# EAGLE schematic v1 (EAGLE 7.6.0)
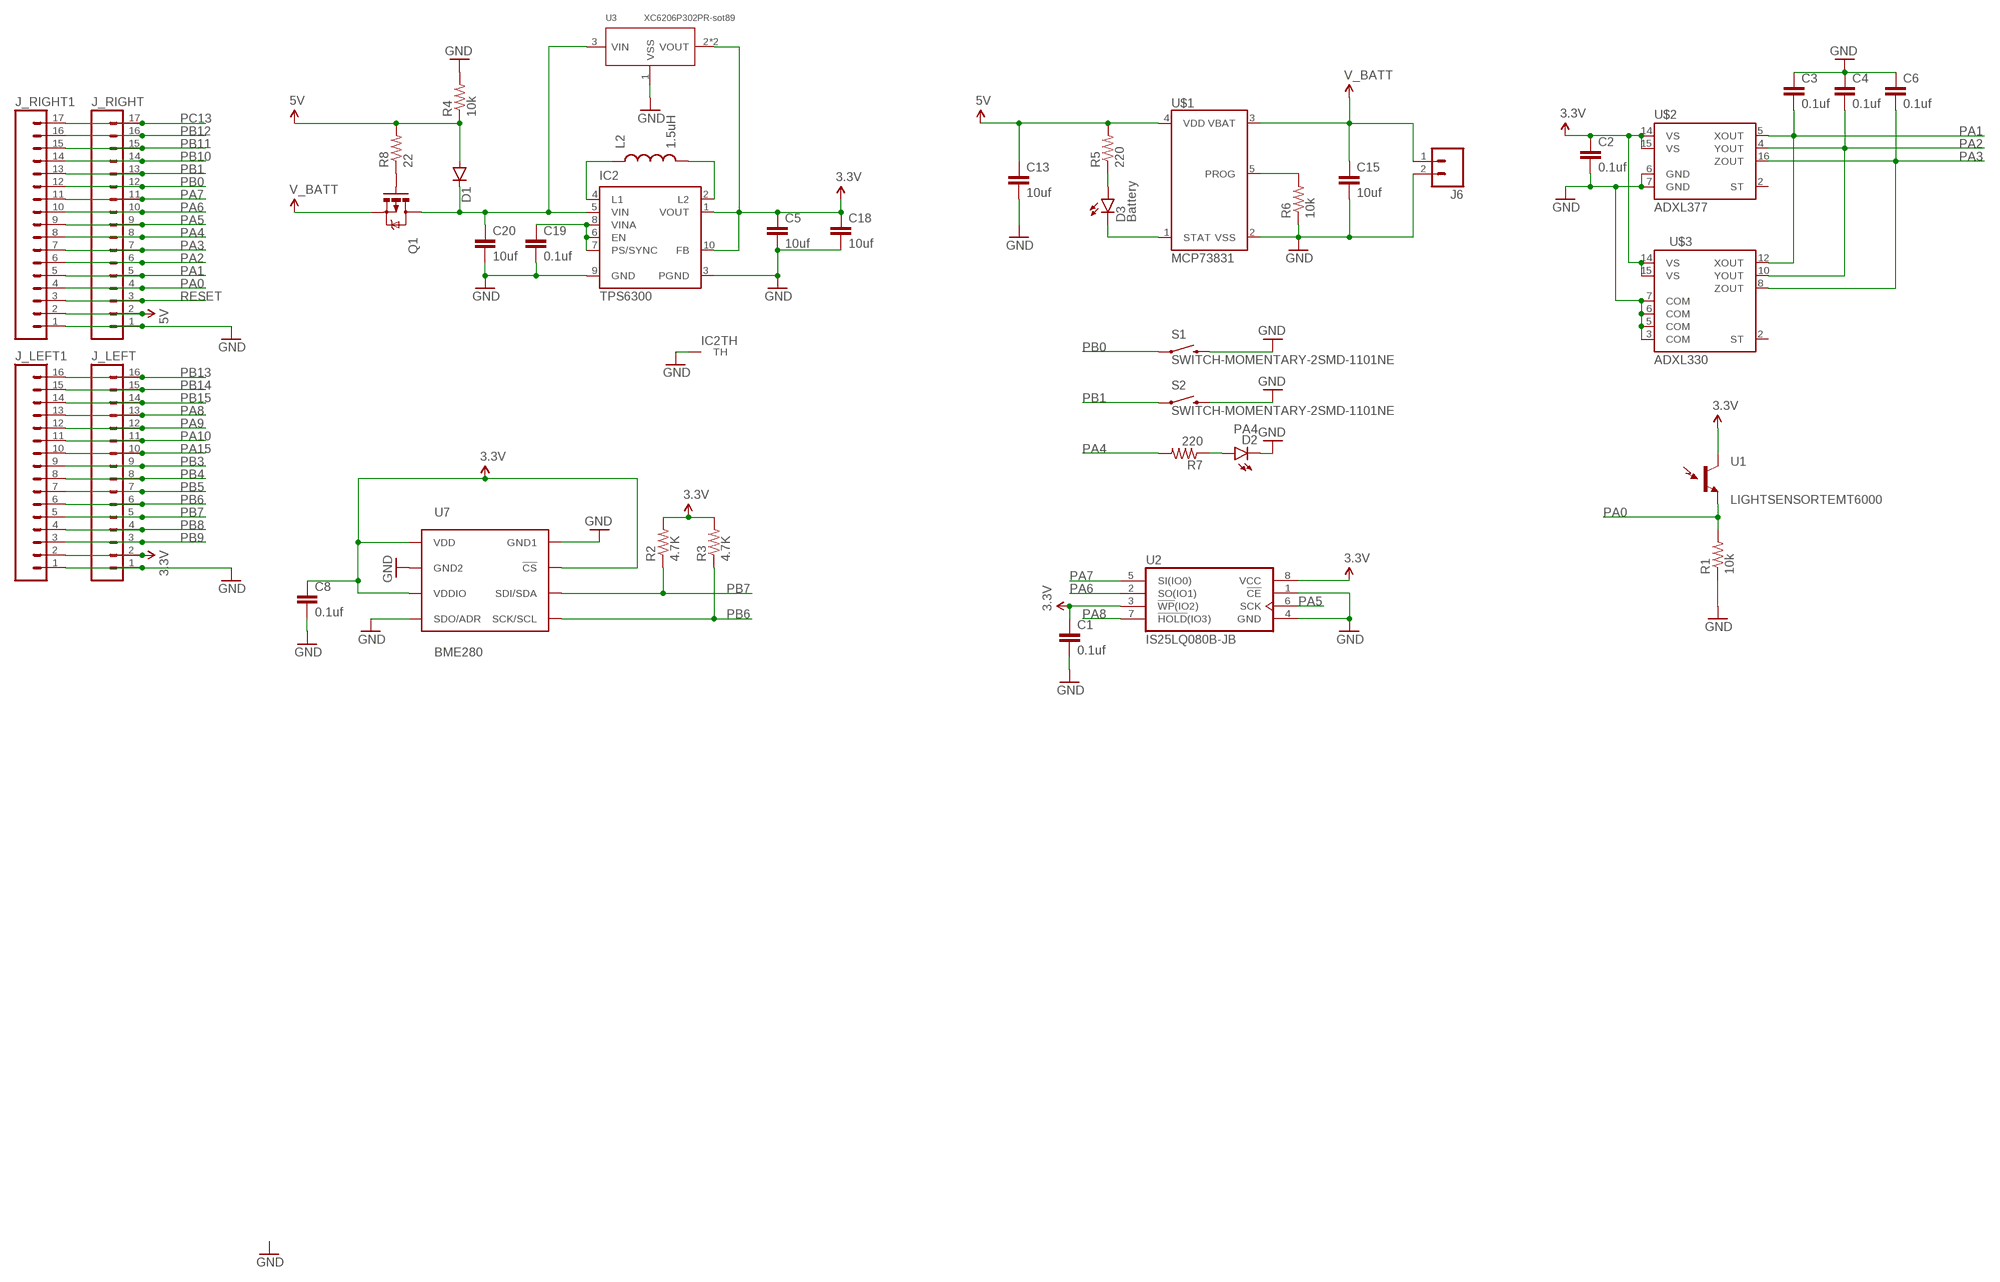
[diagram p0: schematic, sheet 1]

## Parts
C1  0.1uf  CAP0805  [0805]
C2  0.1uf  CAP0805  [0805]
C3  0.1uf  CAP0805  [0805]
C4  0.1uf  CAP0805  [0805]
C5  10uf  CAP0805  [0805]
C6  0.1uf  CAP0805  [0805]
C8  0.1uf  CAP0805  [0805]
C13  10uf  CAP0805  [0805]
C15  10uf  CAP0805  [0805]
C18  10uf  CAP0805  [0805]
C19  0.1uf  CAP0805  [0805]
C20  10uf  CAP0805  [0805]
D1  DIODESOD123  [SOD-123]
D2  PA4  LED1206  [LED-1206]
D3  Battery  LED1206  [LED-1206]
IC2  TPS6300  [DRC-S-PVSON-N10]
J6  M021X02_NO_SILK  [1X02_NO_SILK]
J_LEFT  M161X16_NO_SILK  [1X16_NO_SILK]
J_LEFT1  M161X16_NO_SILK  [1X16_NO_SILK]
J_RIGHT  M17NOSILK  [1X17_NO_SILK]
J_RIGHT1  M17NOSILK  [1X17_NO_SILK]
L2  1.5uH  INDUCTORBOURNS_SRN6045  [SRN6045]
Q1  MOSFET-PCHANNEL  [SOT23-3]
R1  10k  RESISTOR0805-RES  [0805]
R2  4.7K  RESISTOR0805-RES  [0805]
R3  4.7K  RESISTOR0805-RES  [0805]
R4  10k  RESISTOR0805-RES  [0805]
R5  220  RESISTOR0805-RES  [0805]
R6  10k  RESISTOR0805-RES  [0805]
R7  220  RESISTOR0805-RES  [0805]
R8  22  RESISTOR0805-RES  [0805]
S1  SWITCH-MOMENTARY-2SMD-1101NE  [TACTILE-SWITCH-1101NE]
S2  SWITCH-MOMENTARY-2SMD-1101NE  [TACTILE-SWITCH-1101NE]
U1  LIGHTSENSORTEMT6000  [TEMT6000-SEN]
U2  IS25LQ080B-JB  [SO08-JB]
U3  XC6206P302PR-sot89  PMIC-XC6206P302PR(SOT-89)  [SOT-89]
U7  BME280  [BME280_LGA]
U$1  MCP73831  [SOT23-5]
U$2  ADXL377  [LFCSP_LQ-16]
U$3  ADXL330  ADXL330SMD  [LFCSP-16]

## Nets
3.3V: C1.1 C2.1 C5.1 C8.1 C18.1 IC2.1(VOUT) IC2.10(FB) J_LEFT1.2 J_LEFT.2 R2.2 R3.2 U1.COLLECTOR(C1) U2.3(!WP!(IO2)) U2.8(VCC) U3.2(VOUT) U3.4(VOUT) U7.P$2(!CS) U7.P$6(VDDIO) U7.P$8(VDD) U$2.14(VS) U$2.15(VS) U$3.14(VS) U$3.15(VS)
5V: C13.1 D1.A J_RIGHT1.2 J_RIGHT.2 R4.1 R5.2 R8.2 U$1.4(VDD)
GND: C1.2 C2.2 C3.1 C4.1 C5.2 C6.1 C8.2 C13.2 C15.2 C18.2 C19.2 C20.2 D2.C IC2.3(PGND) IC2.9(GND) IC2.TH J6.2 J_LEFT1.1 J_LEFT.1 J_RIGHT1.1 J_RIGHT.1 R1.1 R4.2 R6.1 S1.2 S2.2 U2.1(!CE!) U2.4(GND) U3.1(VSS) U7.P$1(GND1) U7.P$5(SDO/ADR) U7.P$7(GND2) U$1.2(VSS) U$2.6(GND) U$2.7(GND) U$3.3(COM) U$3.5(COM) U$3.6(COM) U$3.7(COM)
N$1: IC2.4(L1) L2.1
N$3: IC2.2(L2) L2.2
N$4: C20.1 D1.C IC2.5(VIN) Q1.3(D) U3.3(VIN)
N$5: D2.A R7.1
N$6: Q1.1(G) R8.1
N$13: D3.A R5.1
N$14: C19.1 IC2.6(EN) IC2.7(PS/SYNC) IC2.8(VINA)
N$17: D3.C U$1.1(STAT)
N$18: R6.2 U$1.5(PROG)
PA0: J_RIGHT1.4 J_RIGHT.4 R1.2 U1.EMITTER(E1)
PA1: C3.2 J_RIGHT1.5 J_RIGHT.5 U$2.5(XOUT) U$3.12(XOUT)
PA2: C4.2 J_RIGHT1.6 J_RIGHT.6 U$2.4(YOUT) U$3.10(YOUT)
PA3: C6.2 J_RIGHT1.7 J_RIGHT.7 U$2.16(ZOUT) U$3.8(ZOUT)
PA4: J_RIGHT1.8 J_RIGHT.8 R7.2
PA5: J_RIGHT1.9 J_RIGHT.9 U2.6(SCK)
PA6: J_RIGHT1.10 J_RIGHT.10 U2.2(SO(IO1))
PA7: J_RIGHT1.11 J_RIGHT.11 U2.5(SI(IO0))
PA8: J_LEFT1.13 J_LEFT.13 U2.7(!HOLD!(IO3))
PA9: J_LEFT1.12 J_LEFT.12
PA10: J_LEFT1.11 J_LEFT.11
PA15: J_LEFT1.10 J_LEFT.10
PB0: J_RIGHT1.12 J_RIGHT.12 S1.1
PB1: J_RIGHT1.13 J_RIGHT.13 S2.1
PB3: J_LEFT1.9 J_LEFT.9
PB4: J_LEFT1.8 J_LEFT.8
PB5: J_LEFT1.7 J_LEFT.7
PB6: J_LEFT1.6 J_LEFT.6 R3.1 U7.P$4(SCK/SCL)
PB7: J_LEFT1.5 J_LEFT.5 R2.1 U7.P$3(SDI/SDA)
PB8: J_LEFT1.4 J_LEFT.4
PB9: J_LEFT1.3 J_LEFT.3
PB10: J_RIGHT1.14 J_RIGHT.14
PB11: J_RIGHT1.15 J_RIGHT.15
PB12: J_RIGHT1.16 J_RIGHT.16
PB13: J_LEFT1.16 J_LEFT.16
PB14: J_LEFT1.15 J_LEFT.15
PB15: J_LEFT1.14 J_LEFT.14
PC13: J_RIGHT1.17 J_RIGHT.17
RESET: J_RIGHT1.3 J_RIGHT.3
V_BATT: C15.1 J6.1 Q1.2(S) U$1.3(VBAT)
Unconnected: U$2.2(ST) U$3.2(ST)

## Library data of the parts
C1-C6 C8 C13 C15 C18-C20 = SparkFun-Capacitors:CAP: Capacitor Standard 0603 ceramic capacitor, and 0.1" leaded capacitor.
D1 = SparkFun-DiscreteSemi:DIODE: Diode These are standard reverse protection diodes and small signal diodes. SMA package can handle up to about 1A. SOD-323 can handle about 200mA. What the SOD-323 package when ordering, there are some mfgs out there that are 5-pin packages.
D2 D3 = SparkFun-LED:LED: LEDs Standard schematic elements and footprints for 5mm, 3mm, 1206, and 0603 sized LEDs. 5mm - Spark Fun Electronics SKU : COM-00529 (and others)
IC2 = texas:TPS6300*: HIGH EFFICIENT SINGLE INDUCTOR BUCK-BOOST CONVERTER WITH 1.8-A SWITCHES Source: http://focus.ti.com/lit/ds/symlink/tps63001.pdf; MPN: TPS63000DRCTG4; OC_FARNELL: 1511852; OC_NEWARK: 59M7217
J6 = SparkFun-Connectors:M02: Standard 2-pin 0.1" header. Use with - straight break away headers ( PRT-00116) - right angle break away headers (PRT-00553) - swiss pins (PRT-00743) - machine pins (PRT-00117) - female headers (PRT-00115) Molex polarized connector foot print use with: PRT-08233 with associated crimp pins and housings. 2.54_SCREWTERM for use with PRT-10571. 3.5mm Screw Terminal footprints for PRT-08084 5mm Screw Terminal footprints for use with PRT-08432
J_LEFT J_LEFT1 = SparkFun-Connectors:M16: 1x16 .1" header
J_RIGHT J_RIGHT1 = SparkFun-Connectors:M17: 1x17 .1" header
L2 = SparkFun-Passives:INDUCTOR: Inductors Basic Inductor/Choke - 0603 and 1206. Footprints are not proven and vary greatly between part numbers. INDUCTOR POWER 3.3UH 4.0A SMD 0.197" L x 0.197" W x 0.177" H (5.00mm x 5.00mm x 4.50mm); PROD_ID: NDUC-11627; VALUE: 33uH
Q1 = SparkFun-DiscreteSemi:MOSFET-PCHANNEL: Generic PMOSFET IRLML2244 - TRANS-11153 (SOT-23 -20V -4.3A) (1.Gate 2.Source 3.Drain) FQP27P06 - COM-10349 <http://www.sparkfun.com/products/10349> (TO-220 -60V -27A) (1.Gate 2.Source 3.Drain); PROD_ID: TRANS-08285
R1-R8 = SparkFun-Resistors:RESISTOR: Resistor Basic schematic elements and footprints for 0603, 1206, and PTH resistors.
S1 S2 = SparkFun-Electromechanical:SWITCH-MOMENTARY-2: Various NO switches- pushbuttons, reed, etc; PROD_ID: SWCH-00815
U1 = SparkFun-Sensors:LIGHTSENSOR: Ambient Light Sensor Simple light detection sensor. Output varies with light intensity input. Spark Fun Electronics SKU : COM-08348
U2 = memory-issi:IS25LQ080B-: EEPROM - 8 Mbit Serial Flash 3V QUAD SERIAL FLASH MEMORY WITH MULTI-I/O SPI
U3 = Seeed-OPL-ic:PMIC-XC6206P302PR(SOT-89): 310030070; MPN: XC6206P302PR
U7 = BME280ComponentLibrary:BME280; PROD_ID: IC-13090
U$1 = GeekAmmo:MCP73831: MCP73831 Miniature Single-Cell, Fully Integrated Li-Ion, Li-Polymer Charge Management Controllers The MCP73831/2 devices are highly advanced linear charge management controllers for use in spacelimited, cost-sensitive applications. http://ww1.microchip.com/downloads/en/DeviceDoc/20001984F.pdf
U$2 = SparkFun-Sensors:ADXL377: ADXL377 Low Power 3-Axis ±200 g Accelerometer with Analog Output.
U$3 = SparkFun-Sensors:ADXL330: Triple Axis Accelerometer Analog Devices ADXL330 +/-3g 2.4V-5.25V Analog output. Spark Fun Electronics SKU : COM-00730. Center pad paste layer has been reduced to avoid shorting.